# EAGLE schematic source_eagle (EAGLE 9.6.2)
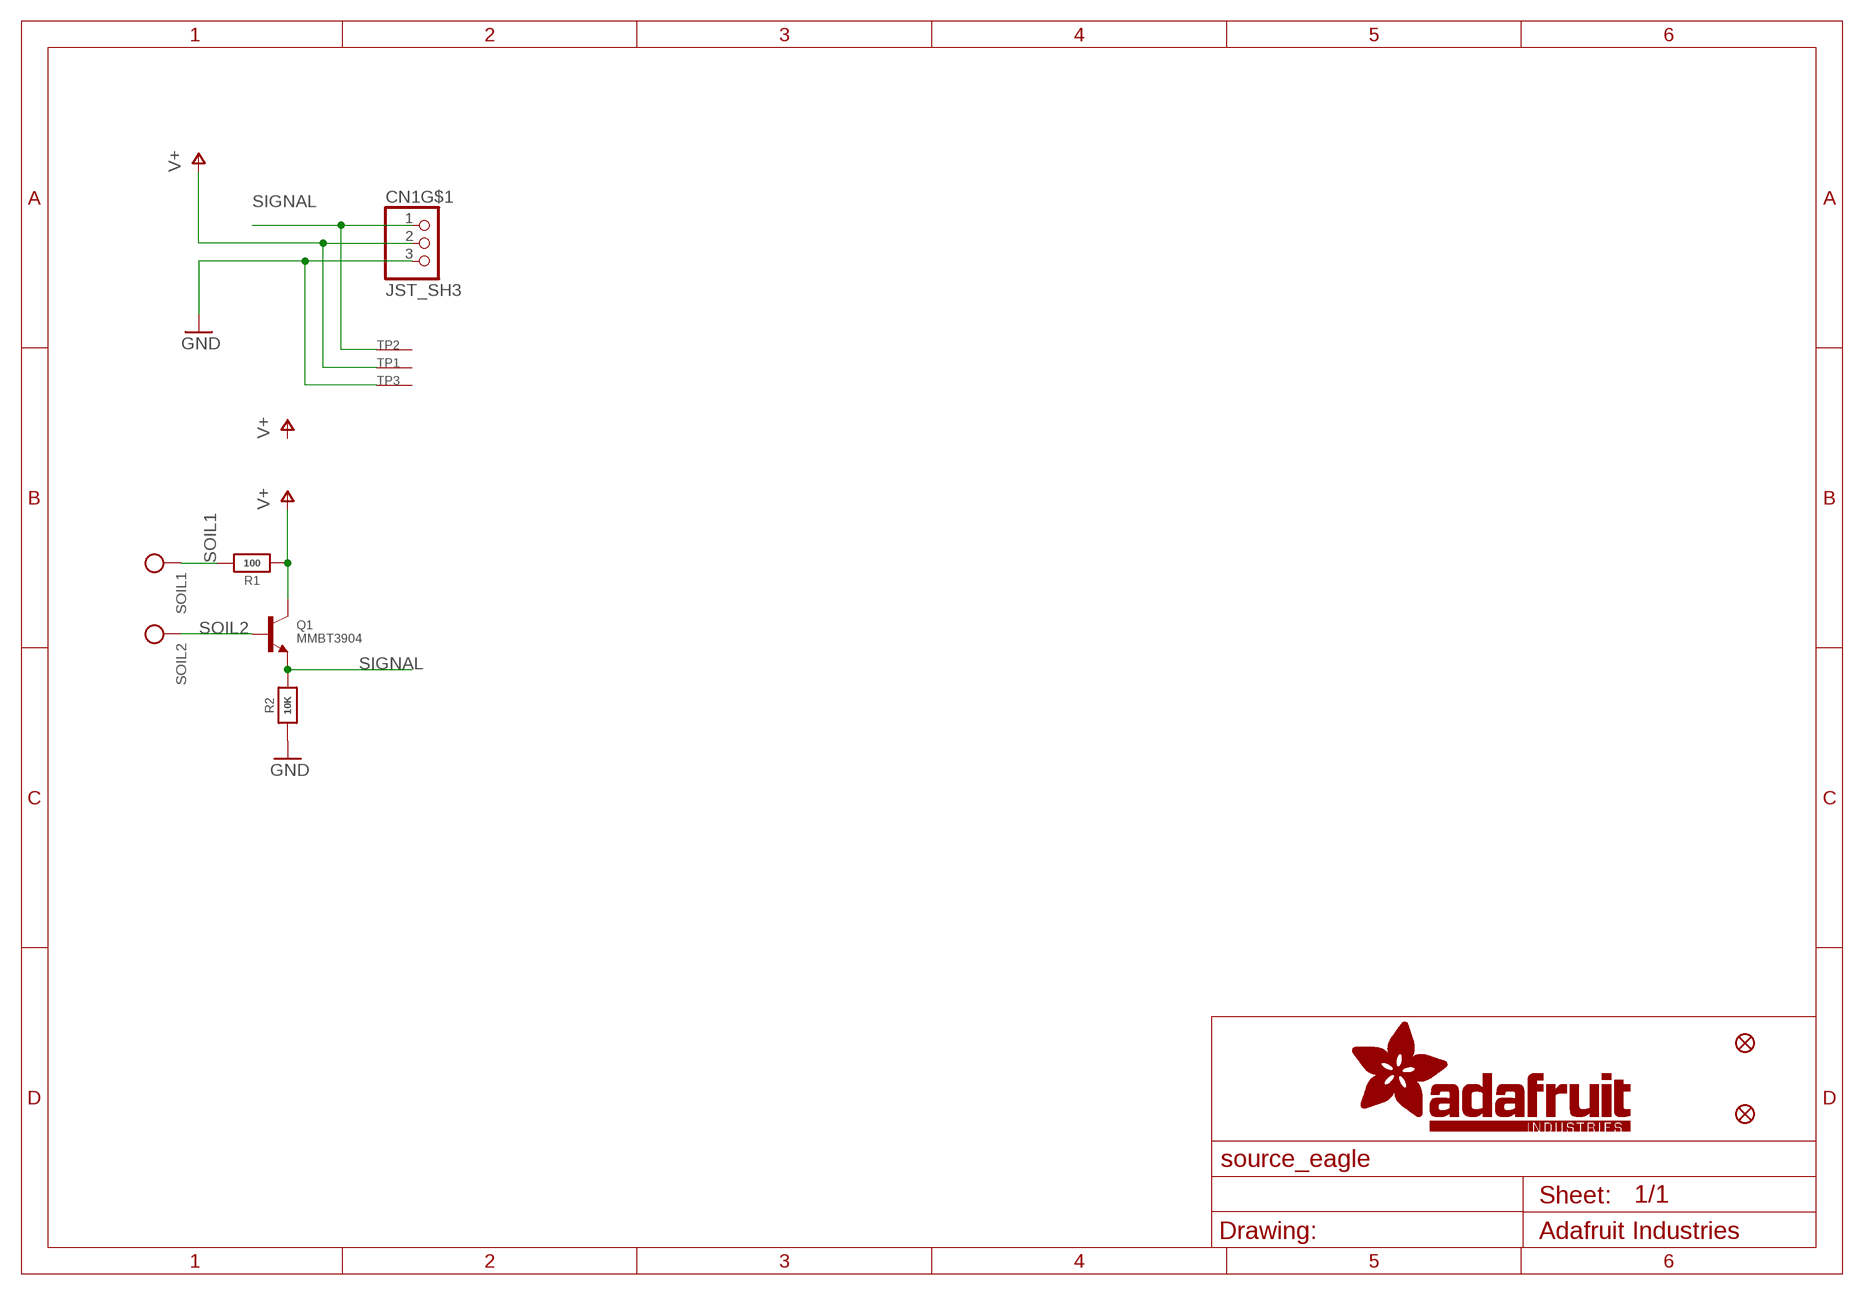
[diagram p0: schematic, sheet 1]

## Parts
CN1  JST_SH3  CON_JST_SH_3PINHORZ  [JST_SH3]
Q1  MMBT3904  TRANSISTOR_NPNWIDE  [SOT23-WIDE]
R1  100  RESISTOR0805_NOOUTLINE  [0805-NO]
R2  10K  RESISTOR0805_NOOUTLINE  [0805-NO]
SOIL1  TESTPOINTROUND2MMNO  [TESTPOINT_ROUND_2MM_NO]
SOIL2  TESTPOINTROUND2MMNO  [TESTPOINT_ROUND_2MM_NO]
TP1  SEWTAPPCB_ALLIGATOR  [PCB_ALLI]
TP2  SEWTAPPCB_ALLIGATOR  [PCB_ALLI]
TP3  SEWTAPPCB_ALLIGATOR  [PCB_ALLI]
U$2  FIDUCIAL_0.5MM  [FIDUCIAL_0.5MM]
U$3  FIDUCIAL_0.5MM  [FIDUCIAL_0.5MM]

## Nets
GND: CN1.3 R2.1 TP3.P$1(SEW)
SIGNAL: CN1.1 Q1.2(E) R2.2 TP2.P$1(SEW)
SOIL1: R1.2 SOIL1.P$1
SOIL2: Q1.1(B) SOIL2.P$1
V+: CN1.2 Q1.3(C) R1.1 TP1.P$1(SEW)
Unconnected: CN1.MT1(MT) CN1.MT2(MT)

## Library data of the parts
CN1 = adafruit_electromech:CON_JST_SH_3PIN
Q1 = microbuilder:TRANSISTOR_NPN: NPN Transistor Transistor (NPN) 500mA 45V - BC817 [Digikey: 568-1631-1-ND] Transistor (NPN) 500mA 45V - BC817,215 [Mouser: 771-BC817-T/R] SOT23-R - SOT23 footprint optimised for use with solder paste and reflow ovens. SOT23-W - SOT23 footprint optimised for hand-soldering (larger pads).
R1 R2 = microbuilder:RESISTOR: Resistors For new designs, use the packages preceded by an '_' character since they are more reliable: The following footprints should be used on most boards: _0402 - Standard footprint for regular board layouts _0603 - Standard footprint for regular board layouts _0805 - Standard footprint for regular board layouts _1206 - Standard footprint for regular board layouts For extremely tight-pitch boards where space is at a premium, the following 'micro-pitch' footprints can be used (smaller pads, no silkscreen outline, etc.): _0402MP - Micro-pitch footprint for very dense/compact boards _0603MP - Micro-pitch footprint for very dense/compact boards _0805MP - Micro-pitch footprint for very dense/compact boards _1206MP - Micro-pitch footprint for very dense/compact boards
SOIL1 SOIL2 = microbuilder:TESTPOINT: Test Point Various test points for characterisation and PCB testing TESTPOINT_SMT - Compact Surface Mount Test Point [Digikey: 5016KTR-ND]
TP1-TP3 = adafruit_electromech:SEWTAP
U$2 U$3 = microbuilder:FIDUCIAL: Fiducial Alignment Points Various fiducial points for machine vision alignment.